# EAGLE design self leveling tray schematic (EAGLE 7.4.0)
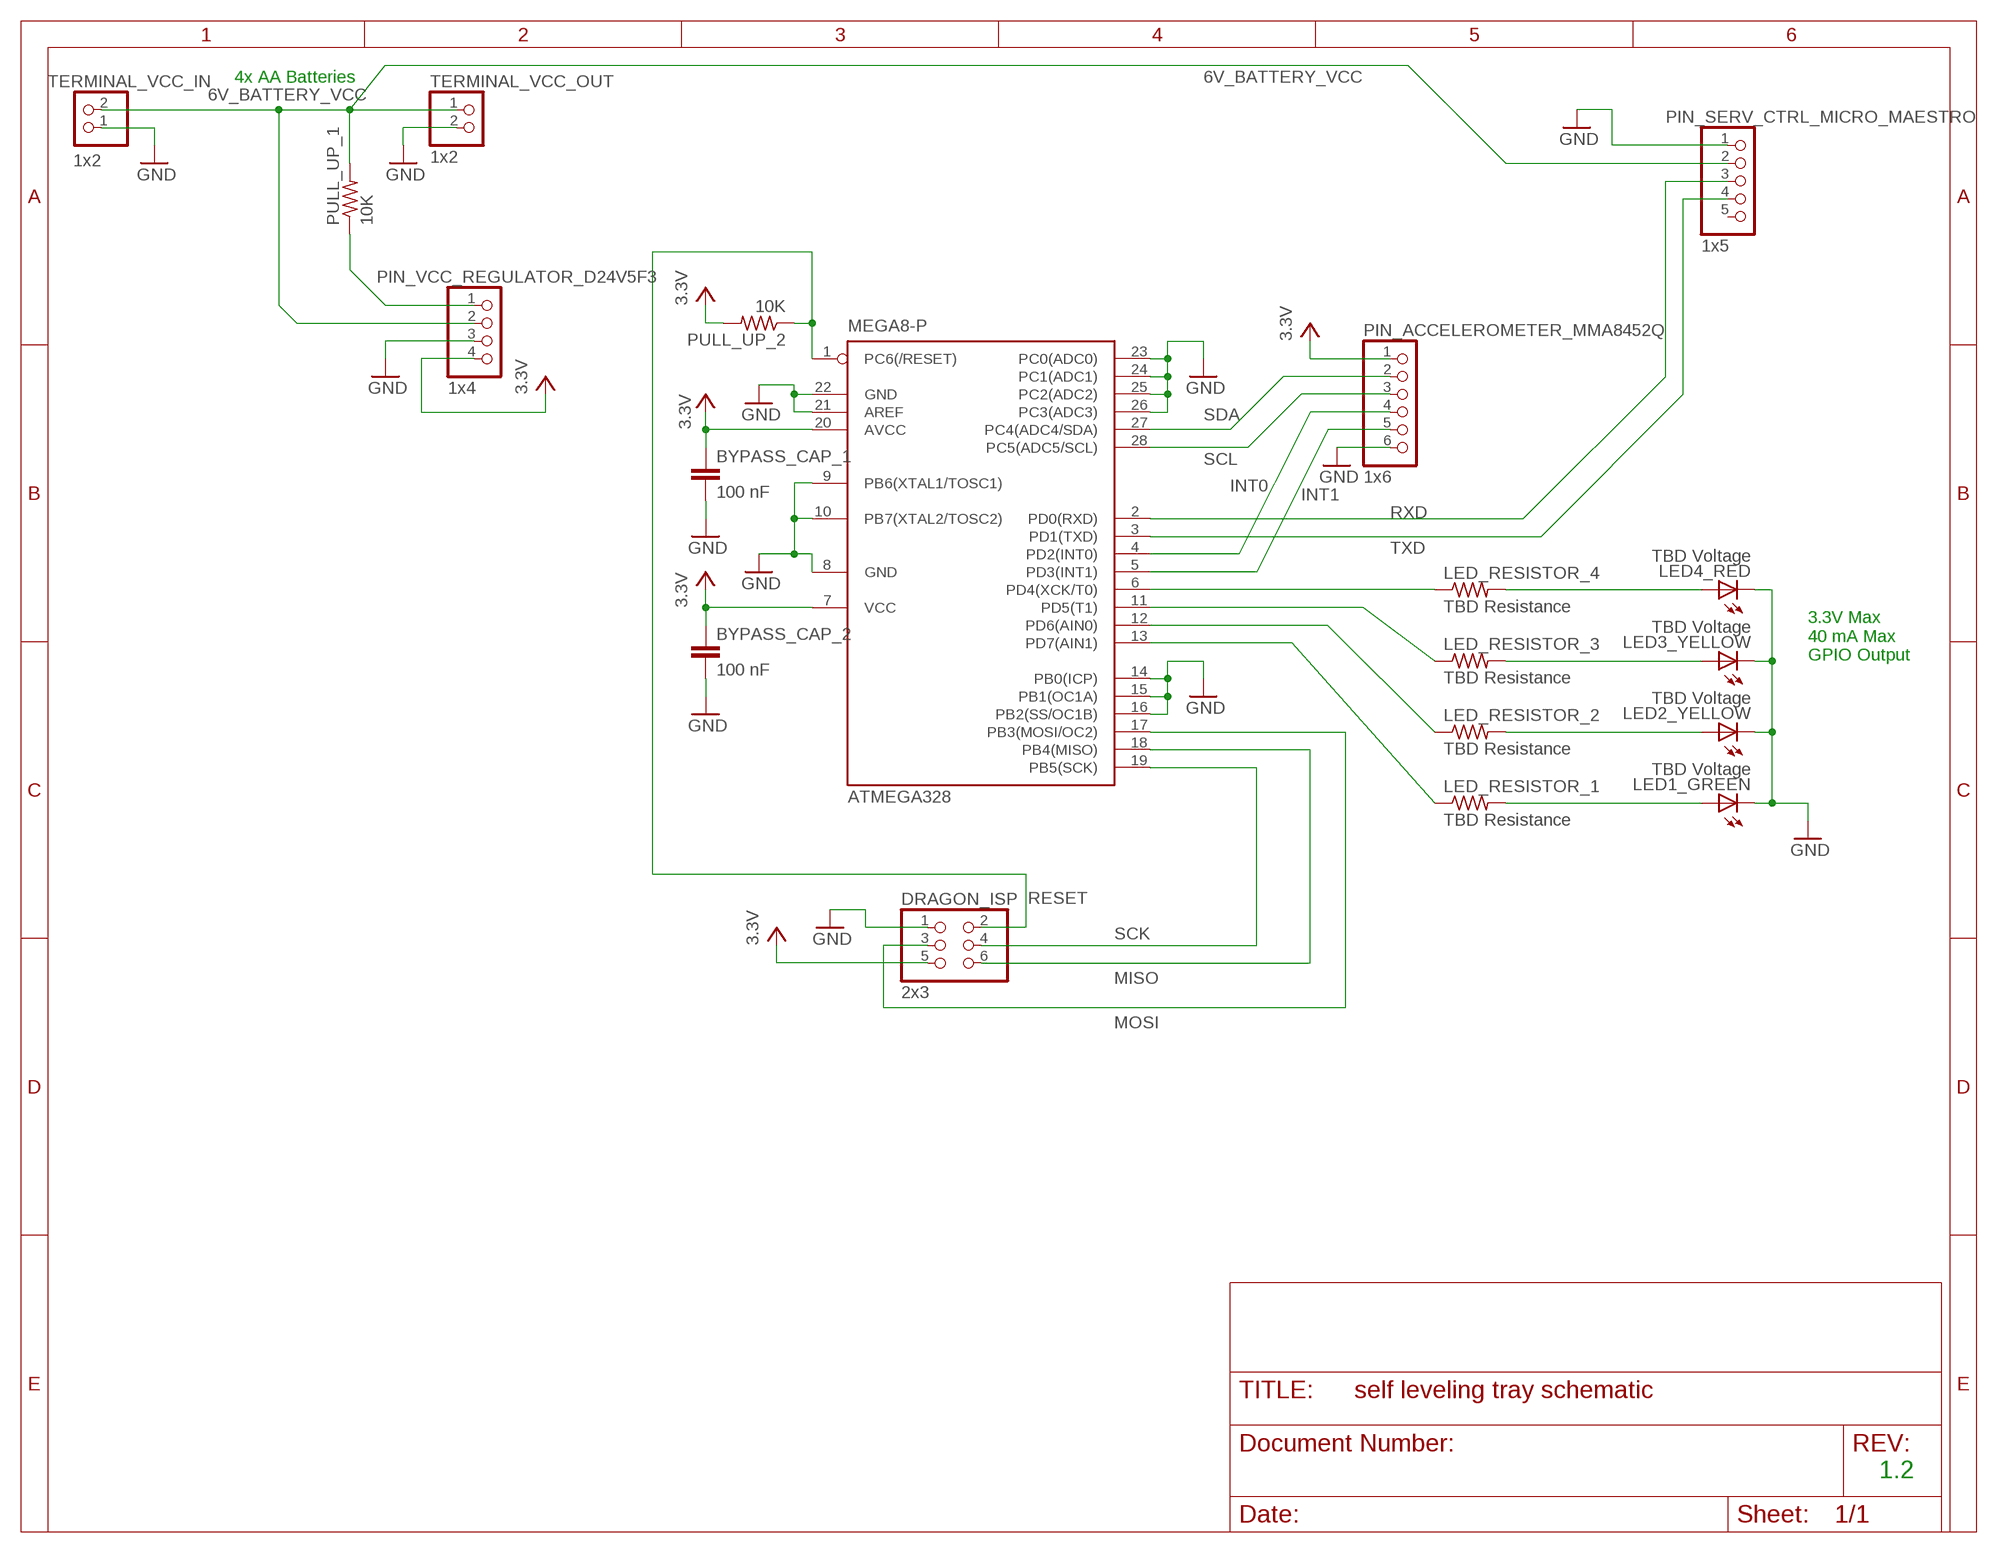
[diagram p0: schematic, sheet 1]

## Parts
ATMEGA328  MEGA8-P  [DIL28-3]
BYPASS_CAP_1  100 nF  C-EUC1206  [C1206]
BYPASS_CAP_2  100 nF  C-EUC1206  [C1206]
DRAGON_ISP  2x3  PINHD-2X3  [2X03]
LED1_GREEN  TBD Voltage  LEDSMT1206  [1206]
LED2_YELLOW  TBD Voltage  LEDSMT1206  [1206]
LED3_YELLOW  TBD Voltage  LEDSMT1206  [1206]
LED4_RED  TBD Voltage  LEDSMT1206  [1206]
LED_RESISTOR_1  TBD Resistance  R-US_R1206  [R1206]
LED_RESISTOR_2  TBD Resistance  R-US_R1206  [R1206]
LED_RESISTOR_3  TBD Resistance  R-US_R1206  [R1206]
LED_RESISTOR_4  TBD Resistance  R-US_R1206  [R1206]
PIN_ACCELEROMETER_MMA8452Q  1x6  PINHD-1X6  [1X06]
PIN_SERV_CTRL_MICRO_MAESTRO  1x5  PINHD-1X5  [1X05]
PIN_VCC_REGULATOR_D24V5F3  1x4  PINHD-1X4  [1X04]
PULL_UP_1  10K  R-US_M1206  [M1206]
PULL_UP_2  10K  R-US_M1206  [M1206]
TERMINAL_VCC_IN  1x2  PINHD-1X2  [1X02]
TERMINAL_VCC_OUT  1x2  PINHD-1X2  [1X02]

## Nets
6V_BATTERY_VCC: PIN_SERV_CTRL_MICRO_MAESTRO.2 PIN_VCC_REGULATOR_D24V5F3.2 PULL_UP_1.2 TERMINAL_VCC_IN.2 TERMINAL_VCC_OUT.1
GND: ATMEGA328.8(GND) ATMEGA328.9(PB6(XTAL1/TOSC1)) ATMEGA328.10(PB7(XTAL2/TOSC2)) ATMEGA328.14(PB0(ICP)) ATMEGA328.15(PB1(OC1A)) ATMEGA328.16(PB2(SS/OC1B)) ATMEGA328.21(AREF) ATMEGA328.22(GND) ATMEGA328.23(PC0(ADC0)) ATMEGA328.24(PC1(ADC1)) ATMEGA328.25(PC2(ADC2)) ATMEGA328.26(PC3(ADC3)) BYPASS_CAP_1.2 BYPASS_CAP_2.2 DRAGON_ISP.1 LED1_GREEN.C LED2_YELLOW.C LED3_YELLOW.C LED4_RED.C PIN_ACCELEROMETER_MMA8452Q.6 PIN_SERV_CTRL_MICRO_MAESTRO.1 PIN_VCC_REGULATOR_D24V5F3.3 TERMINAL_VCC_IN.1 TERMINAL_VCC_OUT.2
INT0: ATMEGA328.4(PD2(INT0)) PIN_ACCELEROMETER_MMA8452Q.4
INT1: ATMEGA328.5(PD3(INT1)) PIN_ACCELEROMETER_MMA8452Q.5
LED_OUT_1: ATMEGA328.13(PD7(AIN1)) LED_RESISTOR_1.1
LED_OUT_2: ATMEGA328.12(PD6(AIN0)) LED_RESISTOR_2.1
LED_OUT_3: ATMEGA328.11(PD5(T1)) LED_RESISTOR_3.1
LED_OUT_4: ATMEGA328.6(PD4(XCK/T0)) LED_RESISTOR_4.1
MISO: ATMEGA328.18(PB4(MISO)) DRAGON_ISP.6
MOSI: ATMEGA328.17(PB3(MOSI/OC2)) DRAGON_ISP.3
N$2: LED1_GREEN.A LED_RESISTOR_1.2
N$3: LED2_YELLOW.A LED_RESISTOR_2.2
N$4: LED3_YELLOW.A LED_RESISTOR_3.2
N$5: LED4_RED.A LED_RESISTOR_4.2
RESET: ATMEGA328.1(PC6(/RESET)) DRAGON_ISP.2 PULL_UP_2.1
RXD: ATMEGA328.2(PD0(RXD)) PIN_SERV_CTRL_MICRO_MAESTRO.3
SCK: ATMEGA328.19(PB5(SCK)) DRAGON_ISP.4
SCL: ATMEGA328.28(PC5(ADC5/SCL)) PIN_ACCELEROMETER_MMA8452Q.3
SDA: ATMEGA328.27(PC4(ADC4/SDA)) PIN_ACCELEROMETER_MMA8452Q.2
SHDN: PIN_VCC_REGULATOR_D24V5F3.1 PULL_UP_1.1
TXD: ATMEGA328.3(PD1(TXD)) PIN_SERV_CTRL_MICRO_MAESTRO.4
VCC: ATMEGA328.7(VCC) ATMEGA328.20(AVCC) BYPASS_CAP_1.1 BYPASS_CAP_2.1 DRAGON_ISP.5 PIN_ACCELEROMETER_MMA8452Q.1 PIN_VCC_REGULATOR_D24V5F3.4 PULL_UP_2.2 ; supply symbol labelled 3.3V
Unconnected: PIN_SERV_CTRL_MICRO_MAESTRO.5

## Notes on the sheet
- 4x AA Batteries
- 3.3V Max
  40 mA Max
  GPIO Output
- 1.2

## Library data of the parts
ATMEGA328 = atmel:MEGA8-P: MICROCONTROLLER 8 Kbytes FLASH, 1 kbytes SRAM, 512 bytes EEPROM, USART, 4-channel 10 bit ADC, 2-channel 8 bit ADC Pin compatible with Atmega48, ATMega88, ATMega168 Source: avr.lbr; OC_FARNELL: unknown; OC_NEWARK: unknown
BYPASS_CAP_1 BYPASS_CAP_2 = rcl:C-EU: CAPACITOR, European symbol
DRAGON_ISP = pinhead:PINHD-2X3: PIN HEADER
LED1_GREEN LED2_YELLOW LED3_YELLOW LED4_RED = led:LED: LED OSRAM: - CHIPLED LG R971, LG N971, LY N971, LG Q971, LY Q971, LO R971, LY R971 LH N974, LH R974 LS Q976, LO Q976, LY Q976 LO Q996 - Hyper CHIPLED LW Q18S LB Q993, LB Q99A, LB R99A - SideLED LS A670, LO A670, LY A670, LG A670, LP A670 LB A673, LV A673, LT A673, LW A673 LH A674 LY A675 LS A676, LA A676, LO A676, LY A676, LW A676 LS A679, LY A679, LG A679 - Hyper Micro SIDELED® LS Y876, LA Y876, LO Y876, LY Y876 LT Y87S - SmartLED LW L88C, LW L88S LB L89C, LB L89S, LG L890 LS L89K, LO L89K, LY L89K LS L896, LA L896, LO L896, LY L896 - TOPLED LS T670, LO T670, LY T670, LG T670, LP T670 LSG T670, LSP T670, LSY T670, LOP T670, LYG T670 LG T671, LOG T671, LSG T671 LB T673, LV T673, LT T673, LW T673 LH T674 LS T676, LA T676, LO T676, LY T676, LB T676, LH T676, LSB T676, LW T676 LB T67C, LV T67C, LT T67C, LS T67K, LO T67K, LY T67K, LW E67C LS E67B, LA E67B, LO E67B, LY E67B, LB E67C, LV E67C, LT E67C LW T67C LS T679, LY T679, LG T679 LS T770, LO T770, LY T770, LG T770, LP T770 LB T773, LV T773, LT T773, LW T773 LH T774 LS E675, LA E675, LY E675, LS T675 LS T776, LA T776, LO T776, LY T776, LB T776 LHGB T686 LT T68C, LB T68C - Hyper Mini TOPLED® LB M676 - Mini TOPLED Santana® LG M470 LS M47K, LO M47K, LY M47K Source: http://www.osram.convergy.de LUXEON: - LUMILED® LXK2-PW12-R00, LXK2-PW12-S00, LXK2-PW14-U00, LXK2-PW14-V00 LXK2-PM12-R00, LXK2-PM12-S00, LXK2-PM14-U00 LXK2-PE12-Q00, LXK2-PE12-R00, LXK2-PE12-S00, LXK2-PE14-T00, LXK2-PE14-U00 LXK2-PB12-K00, LXK2-PB12-L00, LXK2-PB12-M00, LXK2-PB14-N00, LXK2-PB14-P00, LXK2-PB14-Q00 LXK2-PR12-L00, LXK2-PR12-M00, LXK2-PR14-Q00, LXK2-PR14-R00 LXK2-PD12-Q00, LXK2-PD12-R00, LXK2-PD12-S00 LXK2-PH12-R00, LXK2-PH12-S00 LXK2-PL12-P00, LXK2-PL12-Q00, LXK2-PL12-R00 Source: www.luxeon.com KINGBRIGHT: KA-3528ASYC Source: www.kingbright.com
LED_RESISTOR_1-LED_RESISTOR_4 PULL_UP_1 PULL_UP_2 = rcl:R-US_: RESISTOR, American symbol
PIN_ACCELEROMETER_MMA8452Q = pinhead:PINHD-1X6: PIN HEADER
PIN_SERV_CTRL_MICRO_MAESTRO = pinhead:PINHD-1X5: PIN HEADER
PIN_VCC_REGULATOR_D24V5F3 = pinhead:PINHD-1X4: PIN HEADER
TERMINAL_VCC_IN TERMINAL_VCC_OUT = pinhead:PINHD-1X2: PIN HEADER

## Board
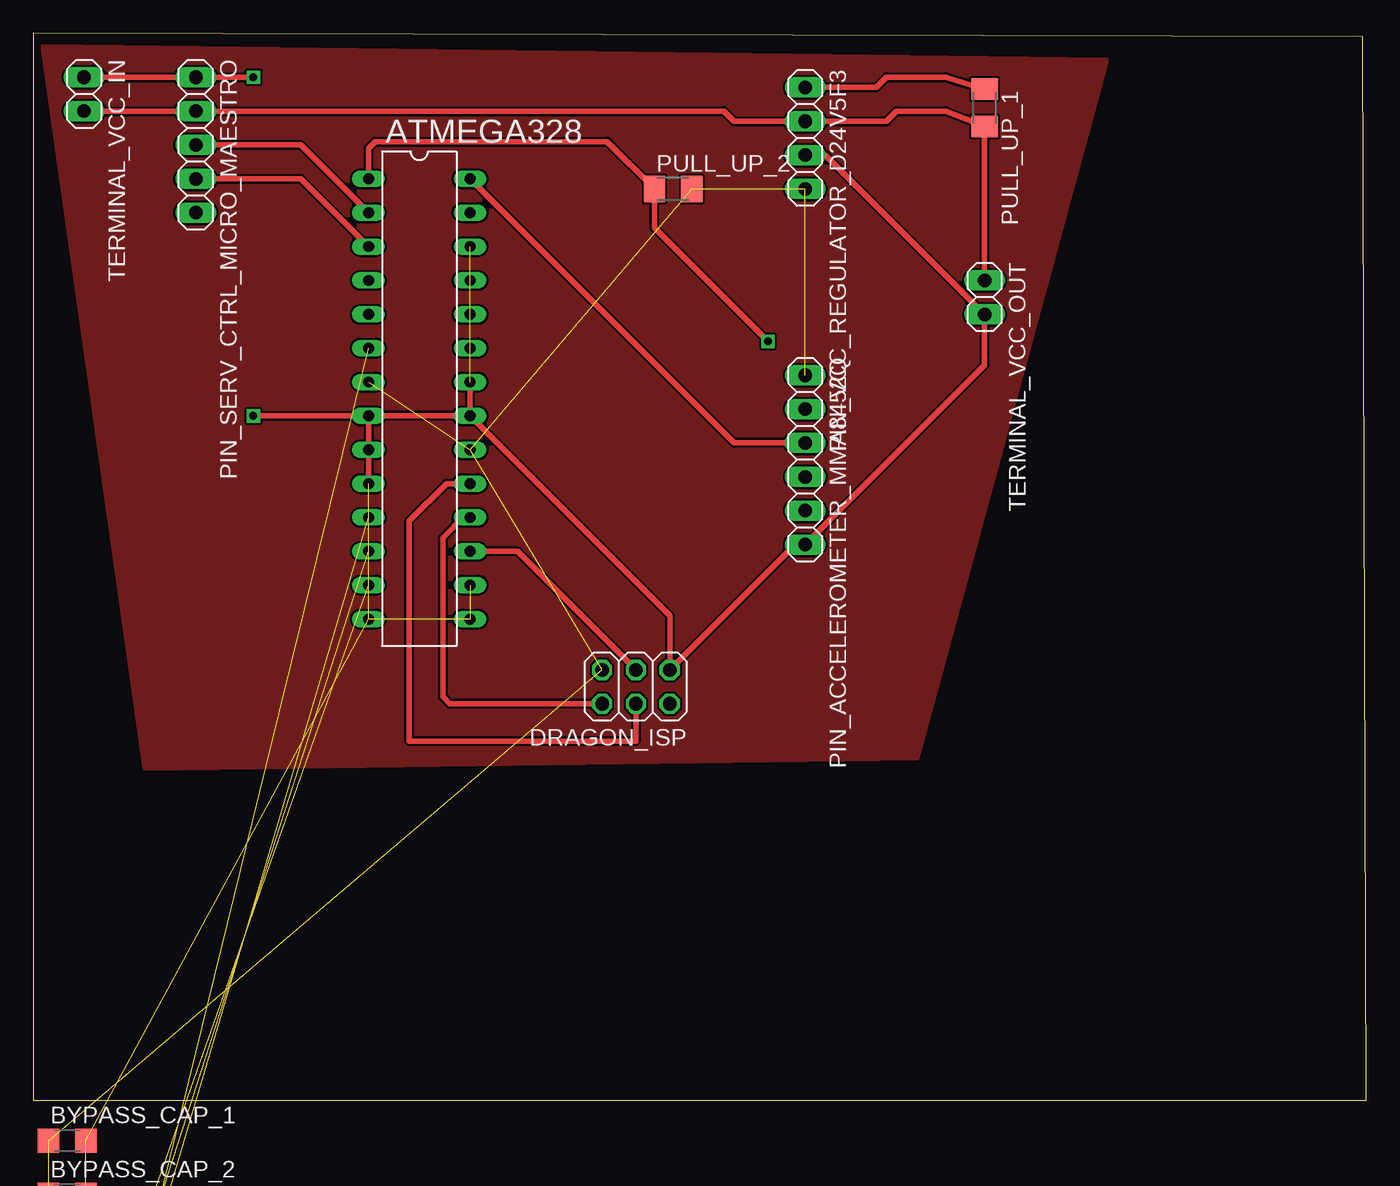
[diagram p1: board, top side]
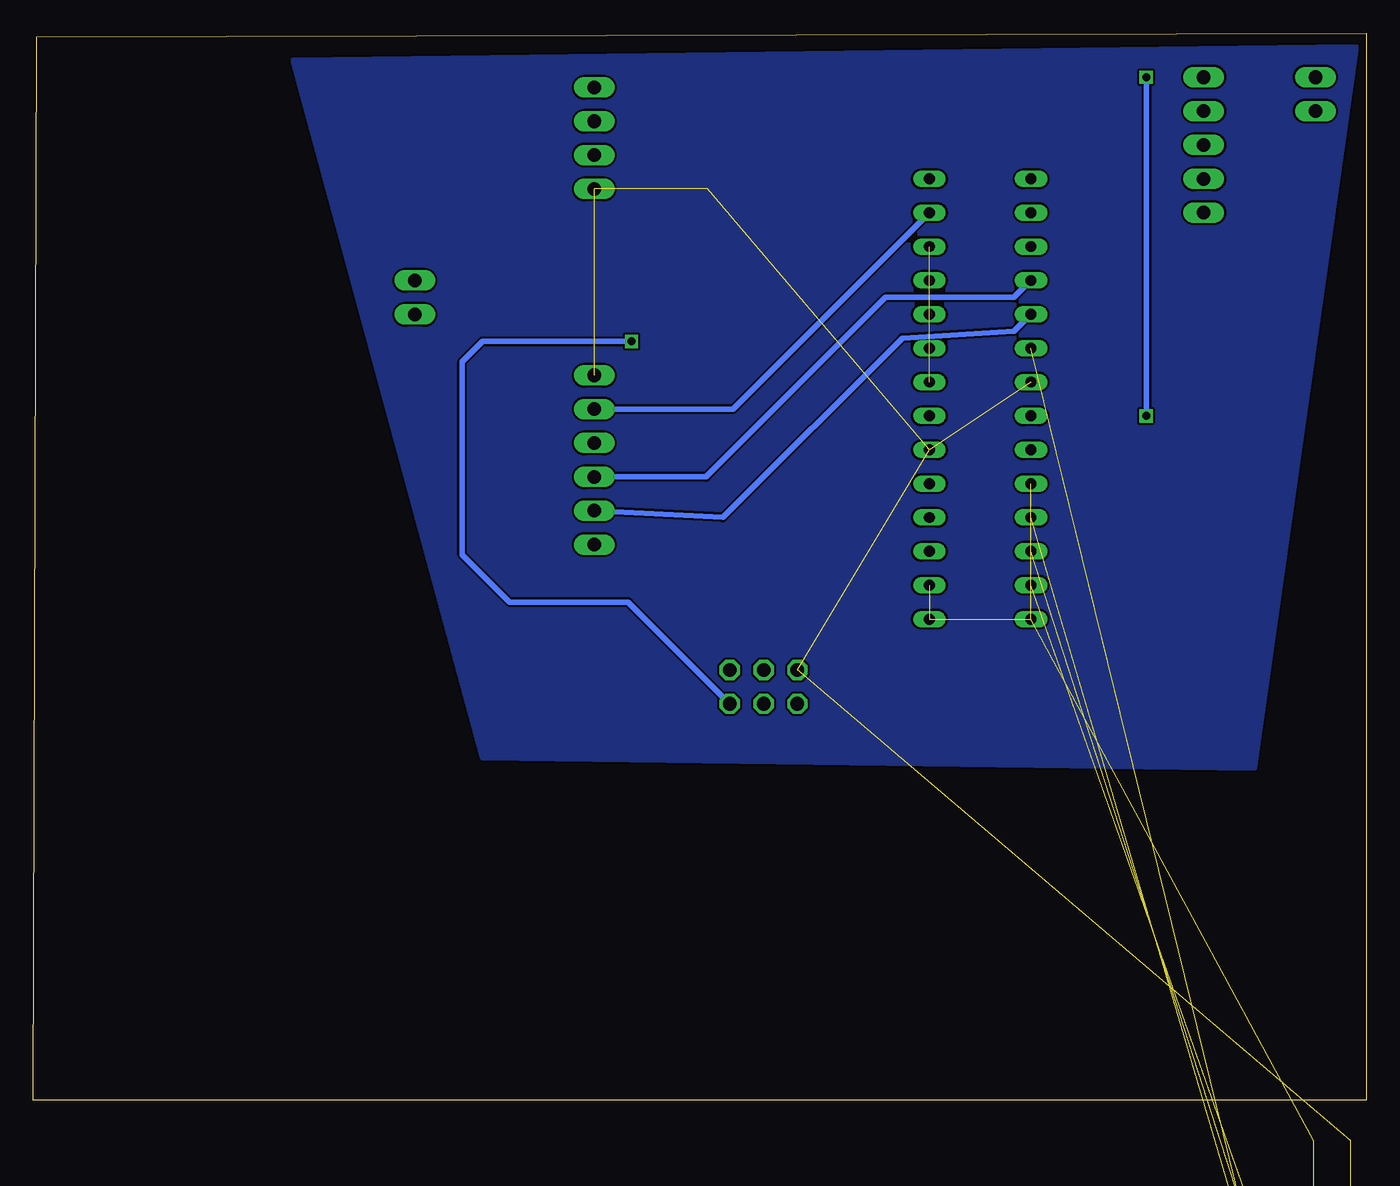
[diagram p2: board, bottom side, seen from below]

Size 100 x 80 mm. Coordinates in mm from the lower left corner, seen from the top.
Outline: 0,0 100,0 99.75,79.75 0,80 0,0
Copper layers (1*16): Top 0.0178mm / dielectric 59mil / Bottom 0.0178mm
Design rules "sunstone-valueproto": minimum track width 7mil, minimum drill 16mil, track to track 7mil, track to pad 7mil, pad to pad 7mil, via to via 7mil, smd to smd 7mil, copper to edge 20mil, drill to drill 16mil, minimum pad ring 8mil, minimum via ring 8mil, stop-mask expansion 3mil, vias tented up to drill 0mil, thermal gap 10mil

### Footprints (pad centres in the part's own frame; a part is rotated, then mirrored left to right if it is on the bottom)
DIL28-3 = drill 0.813 long: 1 -16.51,-3.81; 2 -13.97,-3.81; 3 -11.43,-3.81; 4 -8.89,-3.81; 5 -6.35,-3.81; 6 -3.81,-3.81; 7 -1.27,-3.81; 8 1.27,-3.81; 9 3.81,-3.81; 10 6.35,-3.81; 11 8.89,-3.81; 12 11.43,-3.81; 13 13.97,-3.81; 14 16.51,-3.81; 15 16.51,3.81; 16 13.97,3.81; 17 11.43,3.81; 18 8.89,3.81; 19 6.35,3.81; 20 3.81,3.81; 21 1.27,3.81; 22 -1.27,3.81; 23 -3.81,3.81; 24 -6.35,3.81; 25 -8.89,3.81; 26 -11.43,3.81; 27 -13.97,3.81; 28 -16.51,3.81
C1206 = smd 1.6 x 1.8: 1 -1.4,0; 2 1.4,0
2X03 = drill 1.016 octagon: 1 -2.54,-1.27; 2 -2.54,1.27; 3 0,-1.27; 4 0,1.27; 5 2.54,-1.27; 6 2.54,1.27
1206 = smd 1.6 x 1.803: A -1.422,0; C 1.422,0
R1206 = smd 1.6 x 1.803: 1 -1.422,0; 2 1.422,0
1X06 = drill 1.016 long: 1 -6.35,0; 2 -3.81,0; 3 -1.27,0; 4 1.27,0; 5 3.81,0; 6 6.35,0
1X05 = drill 1.016 long: 1 -5.08,0; 2 -2.54,0; 3 0,0; 4 2.54,0; 5 5.08,0
1X04 = drill 1.016 long: 1 -3.81,0; 2 -1.27,0; 3 1.27,0; 4 3.81,0
M1206 = smd 1.6 x 2: 1 -1.4,0; 2 1.4,0
1X02 = drill 1.016 long: 1 -1.27,0; 2 1.27,0

### Placement (x,y rotation side)
ATMEGA328  28.96,52.58 270 top
BYPASS_CAP_1  2.54,-3.05 0 top  (outside the outline)
BYPASS_CAP_2  2.54,-7.11 0 top  (outside the outline)
DRAGON_ISP  45.21,30.99 180 top
LED1_GREEN  2.54,-13.21 0 top  (outside the outline)
LED2_YELLOW  2.54,-17.27 0 top  (outside the outline)
LED3_YELLOW  2.54,-21.34 0 top  (outside the outline)
LED4_RED  2.54,-25.4 0 top  (outside the outline)
LED_RESISTOR_1  2.54,-29.46 0 top  (outside the outline)
LED_RESISTOR_2  2.54,-33.53 0 top  (outside the outline)
LED_RESISTOR_3  2.54,-37.59 0 top  (outside the outline)
LED_RESISTOR_4  2.54,-41.66 0 top  (outside the outline)
PIN_ACCELEROMETER_MMA8452Q  57.91,48.01 270 top
PIN_SERV_CTRL_MICRO_MAESTRO  12.19,71.63 270 top
PIN_VCC_REGULATOR_D24V5F3  57.91,72.14 270 top
PULL_UP_1  71.37,74.42 270 top
PULL_UP_2  48.01,68.33 0 top
TERMINAL_VCC_IN  3.81,75.44 270 top
TERMINAL_VCC_OUT  71.37,60.2 270 top

### Tracks (layer width: path | path; a pad name or v marks a point on that pad's centre or on a via)
6V_BATTERY_VCC
  Top 0.406: TERMINAL_VCC_IN.2 PIN_SERV_CTRL_MICRO_MAESTRO.2 51.82,74.17 52.58,73.41 PIN_VCC_REGULATOR_D24V5F3.2 64.01,73.41 64.77,74.17 68.45,74.17 PULL_UP_1.2 TERMINAL_VCC_OUT.1
GND  (via drill 0.6)  (13 unrouted)
  Top 0.406: TERMINAL_VCC_IN.1 PIN_SERV_CTRL_MICRO_MAESTRO.1 v16.51,76.71 | PIN_VCC_REGULATOR_D24V5F3.3 59.44,70.87 TERMINAL_VCC_OUT.2 71.37,55.12 PIN_ACCELEROMETER_MMA8452Q.6 57.15,41.66 DRAGON_ISP.1 47.75,36.32 ATMEGA328.21 | ATMEGA328.21 ATMEGA328.22 | ATMEGA328.21 ATMEGA328.8 | ATMEGA328.8 ATMEGA328.9 ATMEGA328.10 | v16.51,51.31 ATMEGA328.8
  Bottom 0.406: v16.51,76.71 v16.51,51.31
INT0
  Bottom 0.406: ATMEGA328.4 26.42,60.2 36.07,60.2 49.53,46.74 PIN_ACCELEROMETER_MMA8452Q.4
INT1
  Bottom 0.406: ATMEGA328.5 26.42,57.66 34.8,57.15 48.26,43.69 PIN_ACCELEROMETER_MMA8452Q.5
LED_OUT_1  (1 unrouted)
LED_OUT_2  (1 unrouted)
LED_OUT_3  (1 unrouted)
LED_OUT_4  (1 unrouted)
MISO
  Top 0.406: DRAGON_ISP.6 31.24,29.72 30.73,30.23 30.73,42.16 32.26,43.69 ATMEGA328.18
MOSI
  Top 0.406: DRAGON_ISP.3 36.32,41.15 ATMEGA328.17
N$1
  pour Top: 0.76,78.99 80.52,77.98 66.29,25.65 8.38,24.89
  pour Bottom: 0.76,78.99 80.52,77.98 66.29,25.65 8.38,24.89
N$2  (1 unrouted)
N$3  (1 unrouted)
N$4  (1 unrouted)
N$5  (1 unrouted)
RESET  (via drill 0.6)
  Top 0.406: ATMEGA328.1 25.15,71.37 25.65,71.88 43.05,71.88 PULL_UP_2.1 46.61,65.41 v55.12,56.9
  Bottom 0.406: DRAGON_ISP.2 55.37,37.34 64.26,37.34 67.82,40.89 67.82,55.37 66.29,56.9 v55.12,56.9
RXD
  Top 0.406: PIN_SERV_CTRL_MICRO_MAESTRO.3 20.07,71.63 ATMEGA328.2
SCK
  Top 0.406: DRAGON_ISP.4 45.21,26.92 28.19,26.92 28.19,43.43 30.99,46.23 ATMEGA328.19
SCL
  Top 0.406: PIN_ACCELEROMETER_MMA8452Q.3 52.58,49.28 ATMEGA328.28
SDA
  Bottom 0.406: ATMEGA328.27 47.5,51.82 PIN_ACCELEROMETER_MMA8452Q.2
SHDN
  Top 0.406: PIN_VCC_REGULATOR_D24V5F3.1 63.25,75.95 64.01,76.71 68.46,76.71 PULL_UP_1.1
TXD
  Top 0.406: PIN_SERV_CTRL_MICRO_MAESTRO.4 20.07,69.09 ATMEGA328.3
VCC  (7 unrouted)